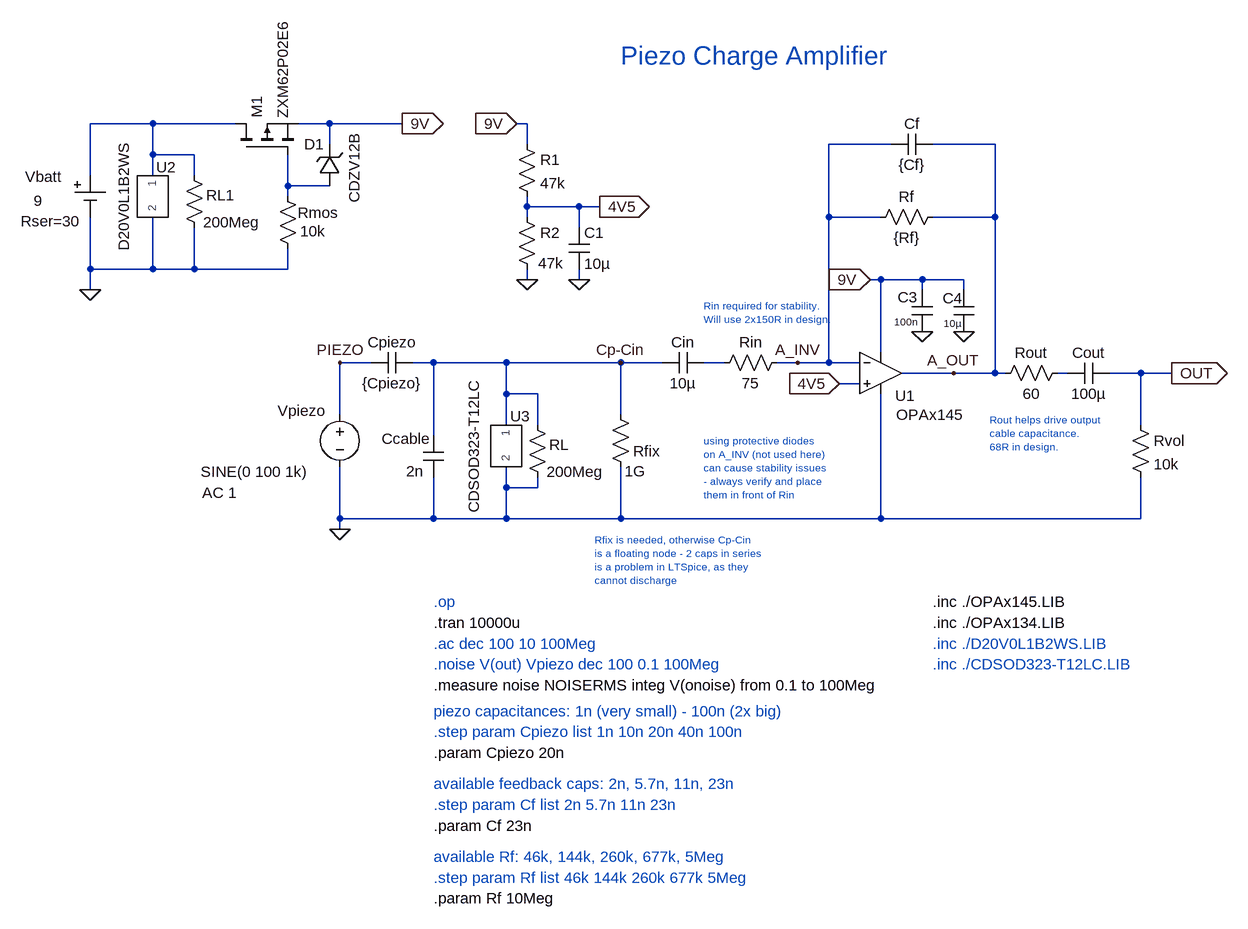
[diagram p0: schematic EOS attempt - charge amp only.asc]
EOS attempt - charge amp only.asc, the LTspice schematic file:
Version 4
SHEET 1 2856 1128
WIRE -688 -80 -784 -80
WIRE -560 -80 -688 -80
WIRE -416 -80 -464 -80
WIRE -304 -80 -416 -80
WIRE -112 -80 -128 -80
WIRE -416 -48 -416 -80
WIRE -112 -48 -112 -80
WIRE 448 -48 352 -48
WIRE 608 -48 512 -48
WIRE -688 -32 -688 -80
WIRE -624 -32 -688 -32
WIRE -784 0 -784 -80
WIRE -688 0 -688 -32
WIRE -624 0 -624 -32
WIRE -480 16 -480 -32
WIRE -416 16 -480 16
WIRE -480 32 -480 16
WIRE -112 48 -112 32
WIRE -32 48 -112 48
WIRE 0 48 -32 48
WIRE -112 64 -112 48
WIRE 352 64 352 -48
WIRE 432 64 352 64
WIRE 608 64 608 -48
WIRE 608 64 512 64
WIRE -32 80 -32 48
WIRE -784 144 -784 64
WIRE -688 144 -688 64
WIRE -688 144 -784 144
WIRE -624 144 -624 80
WIRE -624 144 -688 144
WIRE -480 144 -480 112
WIRE -480 144 -624 144
WIRE -112 160 -112 144
WIRE -32 160 -32 144
WIRE -16 160 -32 160
WIRE 432 160 416 160
WIRE 496 160 432 160
WIRE 560 160 496 160
WIRE -784 176 -784 144
WIRE 496 176 496 160
WIRE 560 176 560 160
WIRE 432 272 432 160
WIRE -352 288 -400 288
WIRE -256 288 -288 288
WIRE -144 288 -256 288
WIRE 32 288 -144 288
WIRE 96 288 32 288
WIRE 192 288 160 288
WIRE 304 288 272 288
WIRE 352 288 352 64
WIRE 352 288 304 288
WIRE 400 288 352 288
WIRE 544 304 464 304
WIRE 608 304 608 64
WIRE 608 304 544 304
WIRE 624 304 608 304
WIRE 720 304 704 304
WIRE 832 304 784 304
WIRE 880 304 832 304
WIRE 400 320 368 320
WIRE -144 336 -144 288
WIRE -96 336 -144 336
WIRE -400 368 -400 288
WIRE 32 368 32 288
WIRE -144 384 -144 336
WIRE -96 384 -96 336
WIRE 832 384 832 304
WIRE -256 400 -256 288
WIRE -144 480 -144 448
WIRE -96 480 -96 464
WIRE -96 480 -144 480
WIRE -400 528 -400 448
WIRE -256 528 -256 464
WIRE -256 528 -400 528
WIRE -144 528 -144 480
WIRE -144 528 -256 528
WIRE 32 528 32 448
WIRE 32 528 -144 528
WIRE 432 528 432 336
WIRE 432 528 32 528
WIRE 832 528 832 464
WIRE 832 528 432 528
WIRE -400 544 -400 528
FLAG 880 304 OUT
IOPIN 880 304 Out
FLAG -784 176 0
FLAG 304 288 A_INV
FLAG -400 544 0
FLAG 544 304 A_OUT
FLAG -400 288 PIEZO
FLAG 416 160 9V
IOPIN 416 160 In
FLAG 496 240 0
FLAG 560 240 0
FLAG 0 48 4V5
IOPIN 0 48 Out
FLAG -112 160 0
FLAG -32 160 0
FLAG -128 -80 9V
IOPIN -128 -80 In
FLAG 32 288 Cp-Cin
FLAG -304 -80 9V
IOPIN -304 -80 Out
FLAG 368 320 4V5
IOPIN 368 320 In
SYMBOL Res 528 48 R90
WINDOW 0 0 56 VBottom 2
WINDOW 3 32 56 VTop 2
SYMATTR InstName Rf
SYMATTR Value {Rf}
SYMBOL Cap 512 -64 R90
WINDOW 0 0 32 VBottom 2
WINDOW 3 32 32 VTop 2
SYMATTR InstName Cf
SYMATTR Value {Cf}
SYMBOL Cap -288 272 R90
WINDOW 0 0 32 VBottom 2
WINDOW 3 32 32 VTop 2
SYMATTR InstName Cpiezo
SYMATTR Value {Cpiezo}
SYMBOL Cap 784 288 R90
WINDOW 0 0 32 VBottom 2
WINDOW 3 32 32 VTop 2
SYMATTR InstName Cout
SYMATTR Value 100µ
SYMBOL voltage -400 352 R0
WINDOW 0 -96 10 Left 2
WINDOW 3 -214 104 Left 2
WINDOW 123 -212 136 Left 2
SYMATTR InstName Vpiezo
SYMATTR Value SINE(0 100 1k)
SYMATTR Value2 AC 1
SYMBOL Res 816 368 R0
SYMATTR InstName Rvol
SYMATTR Value 10k
SYMBOL Opamps/opamp2 432 240 R0
WINDOW 0 22 99 Left 2
WINDOW 3 24 128 Left 2
SYMATTR InstName U1
SYMATTR Value OPAx145
SYMBOL Cap 480 176 R0
WINDOW 0 -22 11 Left 2
WINDOW 3 -27 49 Left 1
SYMATTR InstName C3
SYMATTR Value 100n
SYMBOL Cap 544 176 R0
WINDOW 0 -17 13 Left 2
WINDOW 3 -15 51 Left 1
SYMATTR InstName C4
SYMATTR Value 10µ
SYMBOL Res 16 352 R0
WINDOW 0 35 72 Left 2
WINDOW 3 22 103 Left 2
SYMATTR InstName Rfix
SYMATTR Value 1G
SYMBOL Cap 160 272 R90
WINDOW 0 0 32 VBottom 2
WINDOW 3 32 32 VTop 2
SYMATTR InstName Cin
SYMATTR Value 10µ
SYMBOL Res -128 -64 R0
SYMATTR InstName R1
SYMATTR Value 47k
SYMBOL Res -128 48 R0
WINDOW 3 33 87 Left 2
SYMATTR Value 47k
SYMATTR InstName R2
SYMBOL Cap -48 80 R0
SYMATTR InstName C1
SYMATTR Value 10µ
SYMBOL Misc/cell -784 0 R0
WINDOW 39 -107 70 Left 2
WINDOW 0 -100 2 Left 2
WINDOW 3 -87 39 Left 2
SYMATTR SpiceLine Rser=30
SYMATTR InstName Vbatt
SYMATTR Value 9
SYMBOL Res 720 288 R90
WINDOW 0 0 56 VBottom 2
WINDOW 3 32 56 VTop 2
SYMATTR InstName Rout
SYMATTR Value 60
SYMBOL Res 288 272 R90
WINDOW 0 0 56 VBottom 2
WINDOW 3 32 56 VTop 2
SYMATTR InstName Rin
SYMATTR Value 75
SYMBOL Cap -272 400 R0
WINDOW 0 -64 5 Left 2
WINDOW 3 -26 55 Left 2
SYMATTR InstName Ccable
SYMATTR Value 2n
SYMBOL Res -112 368 R0
WINDOW 0 34 46 Left 2
WINDOW 3 30 88 Left 2
SYMATTR InstName RL
SYMATTR Value 200Meg
SYMBOL CDSOD323-T12LC -144 416 R90
WINDOW 0 -61 -21 VTop 2
WINDOW 3 -1 34 Top 2
SYMATTR InstName U3
SYMBOL D20V0L1B2WS -688 32 R90
WINDOW 0 -60 -21 VTop 2
WINDOW 3 0 29 Top 2
SYMATTR InstName U2
SYMBOL Res -640 -16 R0
WINDOW 0 34 46 Left 2
WINDOW 3 30 88 Left 2
SYMATTR InstName RL1
SYMATTR Value 200Meg
SYMBOL pmos -560 -32 R270
SYMATTR InstName M1
SYMATTR Value ZXM62P02E6
SYMBOL Res -464 128 R180
WINDOW 0 -62 71 Left 2
WINDOW 3 -42 42 Left 2
SYMATTR InstName Rmos
SYMATTR Value 10k
SYMBOL zener -400 16 R180
WINDOW 0 24 64 Left 2
WINDOW 3 -22 -26 VRight 2
SYMATTR InstName D1
SYMATTR Value CDZV12B
TEXT -256 688 Left 2 !.tran 10000u
TEXT -8 560 Left 1 ;Rfix is needed, otherwise Cp-Cin\nis a floating node - 2 caps in series \nis a problem in LTSpice, as they \ncannot discharge
TEXT 512 656 Left 2 !.inc ./OPAx145.LIB
TEXT -256 656 Left 2 ;.op
TEXT 32 -184 Left 4 ;Piezo Charge Amplifier
TEXT -256 720 Left 2 ;.ac dec 100 10 100Meg
TEXT 512 688 Left 2 !.inc ./OPAx134.LIB
TEXT -256 752 Left 2 ;.noise V(out) Vpiezo dec 100 0.1 100Meg
TEXT -256 856 Left 2 ;.step param Cpiezo list 1n 10n 20n 40n 100n
TEXT -256 968 Left 2 ;.step param Cf list 2n 5.7n 11n 23n
TEXT -256 1080 Left 2 ;.step param Rf list 46k 144k 260k 677k 5Meg
TEXT -256 824 Left 2 ;piezo capacitances: 1n (very small) - 100n (2x big)
TEXT -256 936 Left 2 ;available feedback caps: 2n, 5.7n, 11n, 23n
TEXT -256 1048 Left 2 ;available Rf: 46k, 144k, 260k, 677k, 5Meg
TEXT 160 408 Left 1 ;using protective diodes\non A_INV (not used here)\ncan cause stability issues \n- always verify and place \nthem in front of Rin
TEXT 160 200 Left 1 ;Rin required for stability.\nWill use 2x150R in design.
TEXT 600 376 Left 1 ;Rout helps drive output\ncable capacitance.\n68R in design.
TEXT -256 888 Left 2 !.param Cpiezo 20n
TEXT -256 1000 Left 2 !.param Cf 23n
TEXT -256 1112 Left 2 !.param Rf 10Meg
TEXT 512 720 Left 2 ;.inc ./D20V0L1B2WS.LIB
TEXT -256 784 Left 2 !.measure noise NOISERMS integ V(onoise) from 0.1 to 100Meg
TEXT 512 752 Left 2 ;.inc ./CDSOD323-T12LC.LIB

The netlist it stands for:
* EOS attempt - charge amp only.asc
Rf A_OUT A_INV {Rf}
Cf A_OUT A_INV {Cf}
Cpiezo Cp-Cin PIEZO {Cpiezo}
Cout OUT N004 100µ
Vpiezo PIEZO 0 SINE(0 100 1k) AC 1
Rvol OUT 0 10k
XU1 4V5 A_INV 9V 0 A_OUT OPAx145  ; pins In+ In- V+ V- OUT
C3 9V 0 100n
C4 9V 0 10µ
Rfix Cp-Cin 0 1G
Cin N003 Cp-Cin 10µ
R1 9V 4V5 47k
R2 4V5 0 47k
C1 4V5 0 10µ
Vbatt N001 0 9 Rser=30
Rout N004 A_OUT 60
Rin A_INV N003 75
Ccable Cp-Cin 0 2n
RL Cp-Cin 0 200Meg
XU3 Cp-Cin 0 CDSOD323-T12LC  ; pins 1 2
XU2 N001 0 D20V0L1B2WS  ; pins 1 2
RL1 N001 0 200Meg
M1 N001 N002 9V 9V ZXM62P02E6
Rmos 0 N002 10k
D1 N002 9V CDZV12B
.model D D
.lib standard.dio
.model NMOS NMOS
.model PMOS PMOS
.lib standard.mos
.tran 10000u
* Rfix is needed, otherwise Cp-Cin
* is a floating node - 2 caps in series
* is a problem in LTSpice, as they
* cannot discharge
.inc ./OPAx145.LIB
* .op
* Piezo Charge Amplifier
* .ac dec 100 10 100Meg
.inc ./OPAx134.LIB
* .noise V(out) Vpiezo dec 100 0.1 100Meg
* .step param Cpiezo list 1n 10n 20n 40n 100n
* .step param Cf list 2n 5.7n 11n 23n
* .step param Rf list 46k 144k 260k 677k 5Meg
* piezo capacitances: 1n (very small) - 100n (2x big)
* available feedback caps: 2n, 5.7n, 11n, 23n
* available Rf: 46k, 144k, 260k, 677k, 5Meg
* using protective diodes
* on A_INV (not used here)
* can cause stability issues
* - always verify and place
* them in front of Rin
* Rin required for stability.
* Will use 2x150R in design.
* Rout helps drive output
* cable capacitance.
* 68R in design.
.param Cpiezo 20n
.param Cf 23n
.param Rf 10Meg
* .inc ./D20V0L1B2WS.LIB
.measure noise NOISERMS integ V(onoise) from 0.1 to 100Meg
* .inc ./CDSOD323-T12LC.LIB
.lib CDSOD323-T12LC.LIB
.lib D20V0L1B2WS.LIB
.backanno
.end